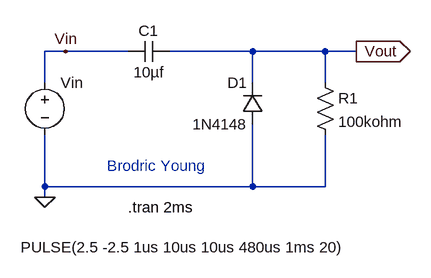
[diagram p0: schematic positive_clamper.asc]
positive_clamper.asc, the LTspice schematic file:
Version 4
SHEET 1 880 680
WIRE 128 96 96 96
WIRE 224 96 128 96
WIRE 416 96 288 96
WIRE 528 96 416 96
WIRE 576 96 528 96
WIRE 96 144 96 96
WIRE 416 144 416 96
WIRE 528 144 528 96
WIRE 96 304 96 224
WIRE 416 304 416 208
WIRE 416 304 96 304
WIRE 528 304 528 224
WIRE 528 304 416 304
WIRE 96 320 96 304
FLAG 128 96 Vin
FLAG 576 96 Vout
IOPIN 576 96 Out
FLAG 96 320 0
SYMBOL voltage 96 128 R0
WINDOW 3 213 285 Bottom 2
WINDOW 123 0 0 Left 0
WINDOW 39 0 0 Left 0
SYMATTR InstName Vin
SYMATTR Value PULSE(2.5 -2.5 1us 10us 10us 480us 1ms 20)
SYMBOL diode 432 208 R180
WINDOW 0 24 64 Left 2
WINDOW 3 24 0 Left 2
SYMATTR InstName D1
SYMATTR Value 1N4148
SYMBOL cap 288 80 R90
WINDOW 0 0 32 VBottom 2
WINDOW 3 32 32 VTop 2
SYMATTR InstName C1
SYMATTR Value 10µf
SYMBOL res 512 128 R0
SYMATTR InstName R1
SYMATTR Value 100kohm
TEXT 192 272 Left 2 ;Brodric Young
TEXT 224 336 Left 2 !.tran 2ms

The netlist it stands for:
* positive_clamper.asc
Vin Vin 0 PULSE(2.5 -2.5 1us 10us 10us 480us 1ms 20)
D1 0 Vout 1N4148
C1 Vout Vin 10µf
R1 Vout 0 100kohm
.model D D
.lib standard.dio
* Brodric Young
.tran 2ms
.backanno
.end

* Results of the author's LTspice run, read from the files saved beside the schematic
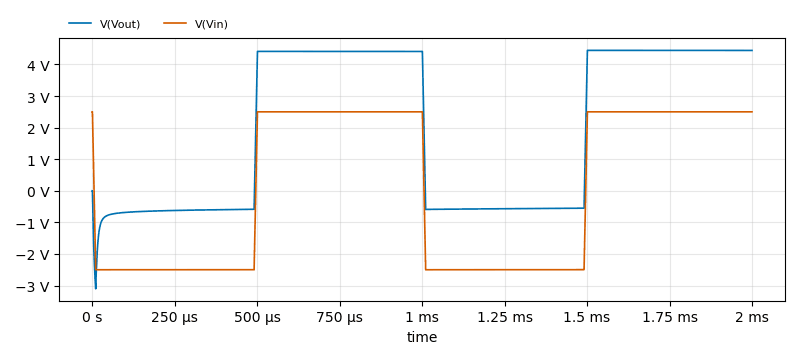
[diagram p1: Transient Analysis of positive_clamper.asc, plotted from the saved traces]
* Transient Analysis, 1 run:
*   V(Vout): min -3.103 V, max 4.446 V, average 1.933 V, rms 3.179 V, last 4.444 V
*   V(Vin): min -2.5 V, max 2.5 V, average 50 mV, rms 2.484 V, last 2.5 V